# EAGLE design OpenPMU_BBB_Cape_V2.3 (EAGLE 9.3.0)
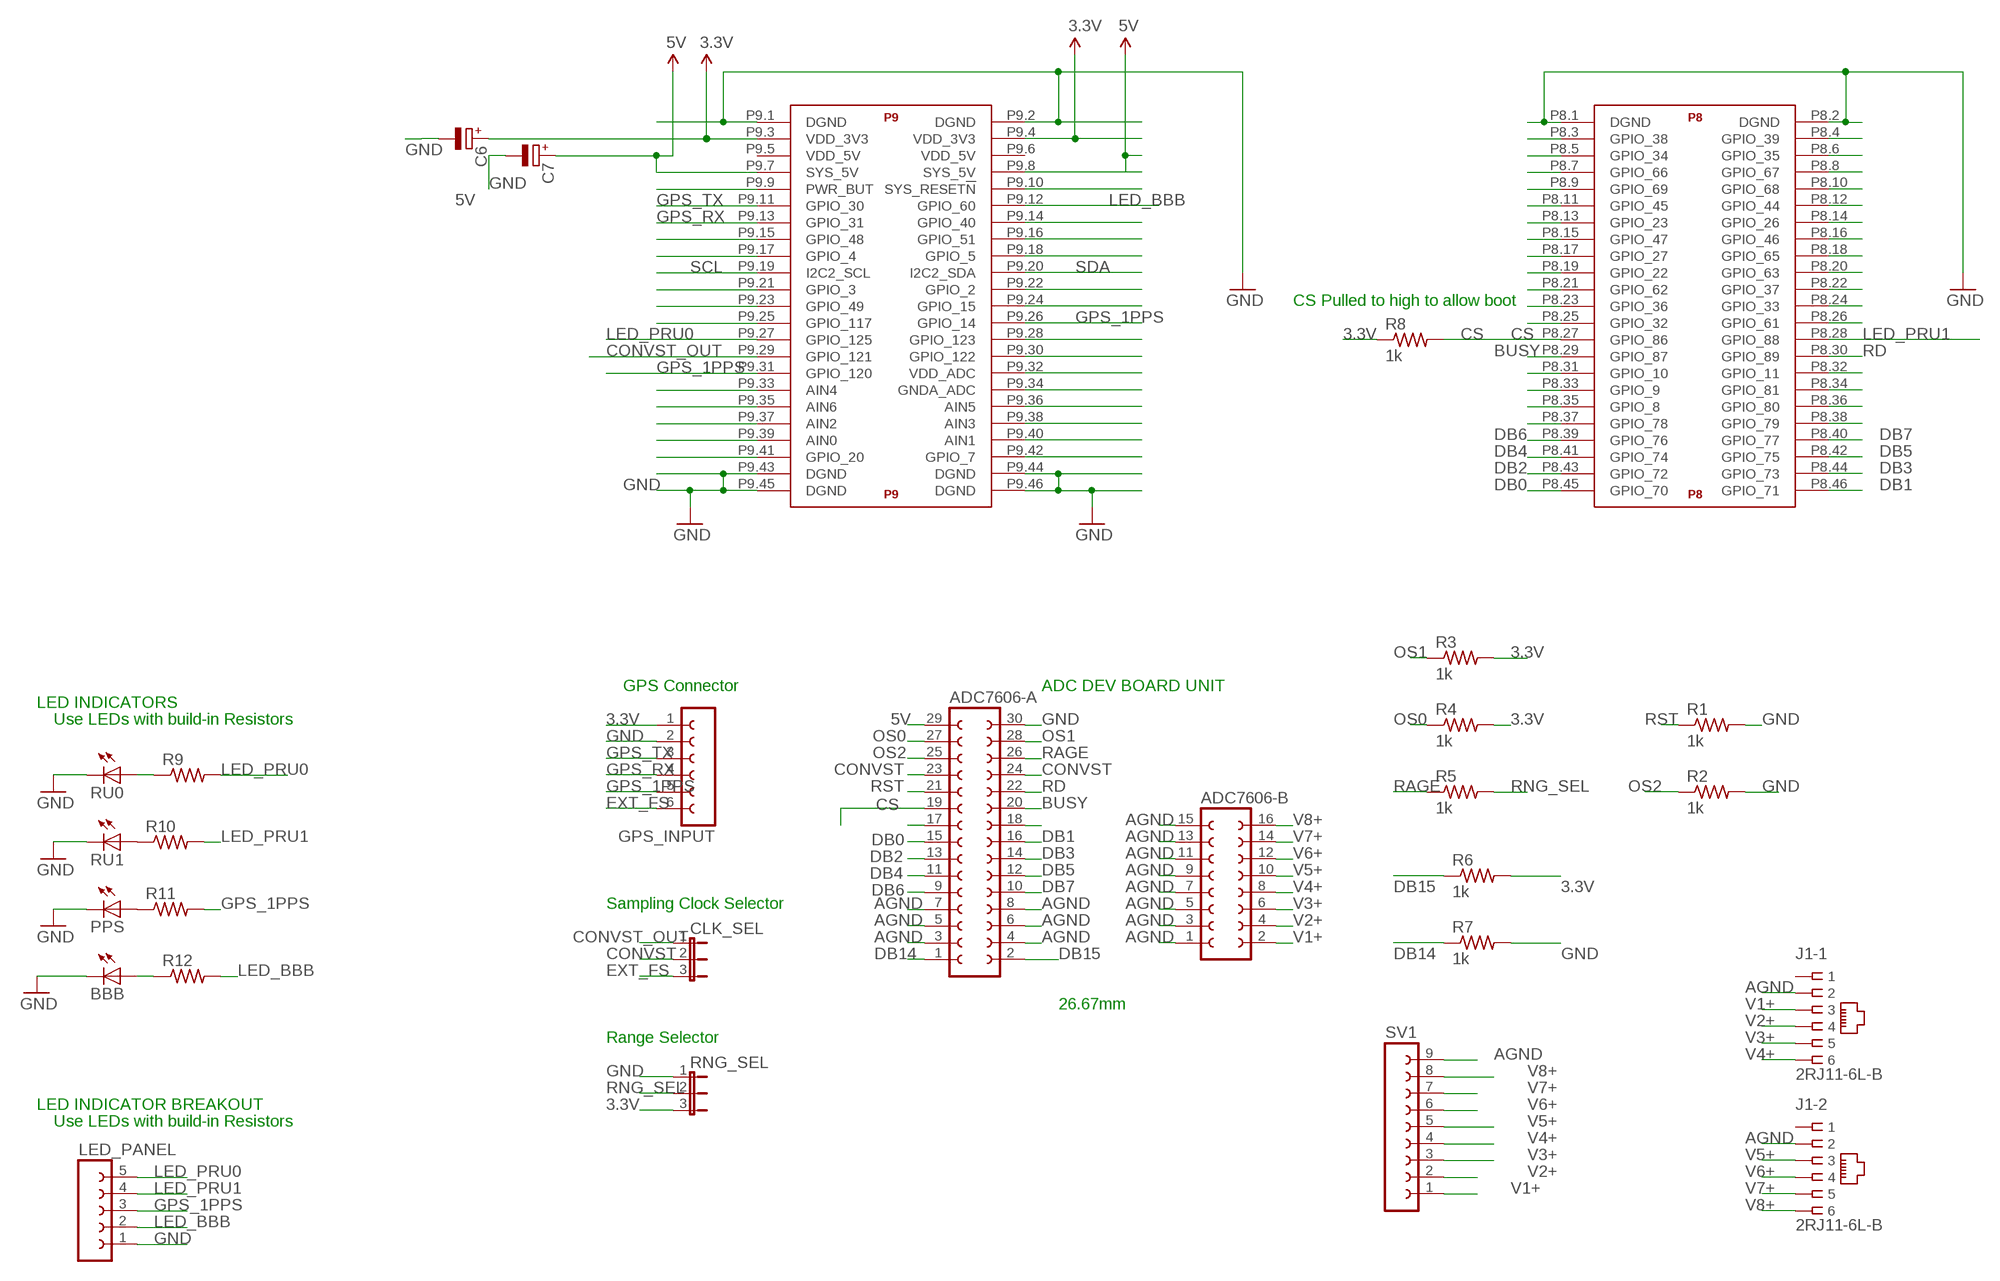
[diagram p0: schematic, sheet 1]

## Parts
ADC7606-A  FE15-2  [FE15-2]
ADC7606-B  FE08-2  [FE08-2]
BBB  LEDCHIPLED_1206  [CHIPLED_1206]
C6  CPOL-EUE1.8-4  [E1,8-4]
C7  CPOL-EUE1.8-4  [E1,8-4]
CLK_SEL  JP2E  [JP2]
GPS_INPUT  FE06-1  [FE06]
J1  2RJ11-6L-B  [2RJ11]
LED_PANEL  FE05-1  [FE05-1]
PPS  LEDCHIPLED_1206  [CHIPLED_1206]
R1  1k  R-US_0204/7  [0204/7]
R2  1k  R-US_0204/7  [0204/7]
R3  1k  R-US_0204/7  [0204/7]
R4  1k  R-US_0204/7  [0204/7]
R5  1k  R-US_0204/7  [0204/7]
R6  1k  R-US_0204/7  [0204/7]
R7  1k  R-US_0204/7  [0204/7]
R8  1k  R-US_0204/7  [0204/7]
R9  R-US_M1206  [M1206]
R10  R-US_M1206  [M1206]
R11  R-US_M1206  [M1206]
R12  R-US_M1206  [M1206]
RNG_SEL  JP2E  [JP2]
RU0  LEDCHIPLED_1206  [CHIPLED_1206]
RU1  LEDCHIPLED_1206  [CHIPLED_1206]
SV1  FE09-1  [FE09]
U$1  BEAGLE_BONE_BLACK_CAPE  [BEAGLE_BONE_BLACK_CAPE]

## Nets
3.3V: C6.+ GPS_INPUT.1 R3.2 R4.2 R6.2 R8.1 RNG_SEL.3 U$1.P9.3(P9:VDD_3V3) U$1.P9.4(P9:VDD_3V3)
5V: ADC7606-A.29 C7.+ U$1.P9.7(P9:SYS_5V) U$1.P9.8(P9:SYS_5V)
AGND: ADC7606-A.3 ADC7606-A.4 ADC7606-A.5 ADC7606-A.6 ADC7606-A.7 ADC7606-A.8 ADC7606-B.1 ADC7606-B.3 ADC7606-B.5 ADC7606-B.7 ADC7606-B.9 ADC7606-B.11 ADC7606-B.13 ADC7606-B.15 J1.1-2 J1.2-2 SV1.9
BUSY: ADC7606-A.20 U$1.P8.29(P8:GPIO_87)
CONVST: ADC7606-A.23 ADC7606-A.24 CLK_SEL.2
CONVST_OUT: CLK_SEL.1 U$1.P9.29(P9:GPIO_121)
CS: ADC7606-A.19 R8.2 U$1.P8.27(P8:GPIO_86)
DB0: ADC7606-A.15 U$1.P8.45(P8:GPIO_70)
DB1: ADC7606-A.16 U$1.P8.46(P8:GPIO_71)
DB2: ADC7606-A.13 U$1.P8.43(P8:GPIO_72)
DB3: ADC7606-A.14 U$1.P8.44(P8:GPIO_73)
DB4: ADC7606-A.11 U$1.P8.41(P8:GPIO_74)
DB5: ADC7606-A.12 U$1.P8.42(P8:GPIO_75)
DB6: ADC7606-A.9 U$1.P8.39(P8:GPIO_76)
DB7: ADC7606-A.10 U$1.P8.40(P8:GPIO_77)
DB14: ADC7606-A.1 R7.1
DB15: ADC7606-A.2 R6.1
EXT_FS: CLK_SEL.3 GPS_INPUT.6
FRST: ADC7606-A.18
GND: ADC7606-A.30 BBB.C C6.- C7.- GPS_INPUT.2 LED_PANEL.1 PPS.C R1.2 R2.2 R7.2 RNG_SEL.1 RU0.C RU1.C U$1.P8.1(P8:DGND) U$1.P8.2(P8:DGND) U$1.P9.1(P9:DGND) U$1.P9.2(P9:DGND) U$1.P9.43(P9:DGND) U$1.P9.44(P9:DGND) U$1.P9.45(P9:DGND) U$1.P9.46(P9:DGND)
GPS_1PPS: GPS_INPUT.5 LED_PANEL.3 R11.2 U$1.P9.26(P9:GPIO_14) U$1.P9.31(P9:GPIO_120)
GPS_RX: GPS_INPUT.4 U$1.P9.13(P9:GPIO_31)
GPS_TX: GPS_INPUT.3 U$1.P9.11(P9:GPIO_30)
LED_BBB: LED_PANEL.2 R12.2 U$1.P9.12(P9:GPIO_60)
LED_PRU0: LED_PANEL.5 R9.2 U$1.P9.27(P9:GPIO_125)
LED_PRU1: LED_PANEL.4 R10.2 U$1.P8.28(P8:GPIO_88)
N$1: R9.1 RU0.A
N$2: R10.1 RU1.A
N$3: PPS.A R11.1
N$4: BBB.A R12.1
N$12: U$1.P8.37(P8:GPIO_78)
N$13: U$1.P8.35(P8:GPIO_8)
N$14: U$1.P8.33(P8:GPIO_9)
N$15: U$1.P8.31(P8:GPIO_10)
N$18: U$1.P8.25(P8:GPIO_32)
N$19: U$1.P8.23(P8:GPIO_36)
N$20: U$1.P8.21(P8:GPIO_62)
N$21: U$1.P8.19(P8:GPIO_22)
N$22: U$1.P8.17(P8:GPIO_27)
N$23: U$1.P8.15(P8:GPIO_47)
N$24: U$1.P8.13(P8:GPIO_23)
N$25: U$1.P8.11(P8:GPIO_45)
N$26: U$1.P8.9(P8:GPIO_69)
N$27: U$1.P8.7(P8:GPIO_66)
N$28: U$1.P8.5(P8:GPIO_34)
N$29: U$1.P8.3(P8:GPIO_38)
N$35: U$1.P8.38(P8:GPIO_79)
N$36: U$1.P8.36(P8:GPIO_80)
N$37: U$1.P8.34(P8:GPIO_81)
N$38: U$1.P8.32(P8:GPIO_11)
N$41: U$1.P8.26(P8:GPIO_61)
N$42: U$1.P8.24(P8:GPIO_33)
N$43: U$1.P8.22(P8:GPIO_37)
N$44: U$1.P8.20(P8:GPIO_63)
N$45: U$1.P8.18(P8:GPIO_65)
N$46: U$1.P8.16(P8:GPIO_46)
N$47: U$1.P8.14(P8:GPIO_26)
N$48: U$1.P8.12(P8:GPIO_44)
N$49: U$1.P8.10(P8:GPIO_68)
N$50: U$1.P8.8(P8:GPIO_67)
N$51: U$1.P8.6(P8:GPIO_35)
N$52: U$1.P8.4(P8:GPIO_39)
N$56: U$1.P9.42(P9:GPIO_7)
N$57: U$1.P9.40(P9:AIN1)
N$58: U$1.P9.38(P9:AIN3)
N$59: U$1.P9.36(P9:AIN5)
N$60: U$1.P9.34(P9:GNDA_ADC)
N$61: U$1.P9.32(P9:VDD_ADC)
N$62: U$1.P9.30(P9:GPIO_122)
N$63: U$1.P9.28(P9:GPIO_123)
N$65: U$1.P9.24(P9:GPIO_15)
N$66: U$1.P9.22(P9:GPIO_2)
N$68: U$1.P9.18(P9:GPIO_5)
N$69: U$1.P9.16(P9:GPIO_51)
N$70: U$1.P9.14(P9:GPIO_40)
N$72: U$1.P9.10(P9:SYS_RESET!N)
N$79: U$1.P9.41(P9:GPIO_20)
N$80: U$1.P9.39(P9:AIN0)
N$81: U$1.P9.37(P9:AIN2)
N$82: U$1.P9.35(P9:AIN6)
N$83: U$1.P9.33(P9:AIN4)
N$87: U$1.P9.25(P9:GPIO_117)
N$88: U$1.P9.23(P9:GPIO_49)
N$89: U$1.P9.21(P9:GPIO_3)
N$91: U$1.P9.17(P9:GPIO_4)
N$92: U$1.P9.15(P9:GPIO_48)
N$95: U$1.P9.9(P9:PWR_BUT)
OS0: ADC7606-A.27 R4.1
OS1: ADC7606-A.28 R3.1
OS2: ADC7606-A.25 R2.1
RAGE: ADC7606-A.26 R5.1
RD: ADC7606-A.22 U$1.P8.30(P8:GPIO_89)
RNG_SEL: R5.2 RNG_SEL.2
RST: ADC7606-A.21 R1.1
SCL: U$1.P9.19(P9:I2C2_SCL)
SDA: U$1.P9.20(P9:I2C2_SDA)
V1+: ADC7606-B.2 J1.1-3 SV1.1
V2+: ADC7606-B.4 J1.1-4 SV1.2
V3+: ADC7606-B.6 J1.1-5 SV1.3
V4+: ADC7606-B.8 J1.1-6 SV1.4
V5+: ADC7606-B.10 J1.2-3 SV1.5
V6+: ADC7606-B.12 J1.2-4 SV1.6
V7+: ADC7606-B.14 J1.2-5 SV1.7
V8+: ADC7606-B.16 J1.2-6 SV1.8
VI0: ADC7606-A.17
Unconnected: J1.1-1 J1.2-1 U$1.P9.5(P9:VDD_5V) U$1.P9.6(P9:VDD_5V)

## Notes on the sheet
- CS Pulled to high to allow boot
- GPS Connector | ADC DEV BOARD UNIT
- LED INDICATORS
- Use LEDs with build-in Resistors
- Sampling Clock Selector
- 26.67mm
- Range Selector
- LED INDICATOR BREAKOUT
- Use LEDs with build-in Resistors

## Library data of the parts
ADC7606-A = con-lsta:FE15-2: FEMALE HEADER; OC_FARNELL: unknown; OC_NEWARK: unknown
ADC7606-B = con-lsta:FE08-2: FEMALE HEADER; OC_FARNELL: unknown; OC_NEWARK: unknown
BBB PPS RU0 RU1 = led:LED: LED OSRAM: - CHIPLED LG R971, LG N971, LY N971, LG Q971, LY Q971, LO R971, LY R971 LH N974, LH R974 LS Q976, LO Q976, LY Q976 LO Q996 - Hyper CHIPLED LW Q18S LB Q993, LB Q99A, LB R99A - SideLED LS A670, LO A670, LY A670, LG A670, LP A670 LB A673, LV A673, LT A673, LW A673 LH A674 LY A675 LS A676, LA A676, LO A676, LY A676, LW A676 LS A679, LY A679, LG A679 - Hyper Micro SIDELED® LS Y876, LA Y876, LO Y876, LY Y876 LT Y87S - SmartLED LW L88C, LW L88S LB L89C, LB L89S, LG L890 LS L89K, LO L89K, LY L89K LS L896, LA L896, LO L896, LY L896 - TOPLED LS T670, LO T670, LY T670, LG T670, LP T670 LSG T670, LSP T670, LSY T670, LOP T670, LYG T670 LG T671, LOG T671, LSG T671 LB T673, LV T673, LT T673, LW T673 LH T674 LS T676, LA T676, LO T676, LY T676, LB T676, LH T676, LSB T676, LW T676 LB T67C, LV T67C, LT T67C, LS T67K, LO T67K, LY T67K, LW E67C LS E67B, LA E67B, LO E67B, LY E67B, LB E67C, LV E67C, LT E67C LW T67C LS T679, LY T679, LG T679 LS T770, LO T770, LY T770, LG T770, LP T770 LB T773, LV T773, LT T773, LW T773 LH T774 LS E675, LA E675, LY E675, LS T675 LS T776, LA T776, LO T776, LY T776, LB T776 LHGB T686 LT T68C, LB T68C - Hyper Mini TOPLED® LB M676 - Mini TOPLED Santana® LG M470 LS M47K, LO M47K, LY M47K Source: http://www.osram.convergy.de LUXEON: - LUMILED® LXK2-PW12-R00, LXK2-PW12-S00, LXK2-PW14-U00, LXK2-PW14-V00 LXK2-PM12-R00, LXK2-PM12-S00, LXK2-PM14-U00 LXK2-PE12-Q00, LXK2-PE12-R00, LXK2-PE12-S00, LXK2-PE14-T00, LXK2-PE14-U00 LXK2-PB12-K00, LXK2-PB12-L00, LXK2-PB12-M00, LXK2-PB14-N00, LXK2-PB14-P00, LXK2-PB14-Q00 LXK2-PR12-L00, LXK2-PR12-M00, LXK2-PR14-Q00, LXK2-PR14-R00 LXK2-PD12-Q00, LXK2-PD12-R00, LXK2-PD12-S00 LXK2-PH12-R00, LXK2-PH12-S00 LXK2-PL12-P00, LXK2-PL12-Q00, LXK2-PL12-R00 Source: www.luxeon.com KINGBRIGHT: KA-3528ASYC Source: www.kingbright.com
C6 C7 = resistor:CPOL-EU: POLARIZED CAPACITOR, European symbol
CLK_SEL RNG_SEL = jumper:JP2E: JUMPER
GPS_INPUT = con-lsta:FE06-1: FEMALE HEADER; OC_FARNELL: unknown; OC_NEWARK: unknown
J1 = con-tycoelectronics:2RJ11-6L-B: CORCOM Modular RJ Jacks L - Ganged Series Source: www.tycoelectronics.com .. ENG_DS_1654001_1099_RJ_L_0507.pdf; MF: TYCO ELECTRONICS; MPN: 2RJ11-6L-B; OC_FARNELL: unknown; OC_NEWARK: 48F3954
LED_PANEL = con-lsta:FE05-1: FEMALE HEADER; OC_FARNELL: unknown; OC_NEWARK: unknown
R1-R12 = adafruit:R-US_: RESISTOR, American symbol
SV1 = con-lsta:FE09-1: FEMALE HEADER; OC_FARNELL: unknown; OC_NEWARK: unknown
U$1 = SparkFun-Boards:BEAGLE_BONE_BLACK_CAPE

## Board
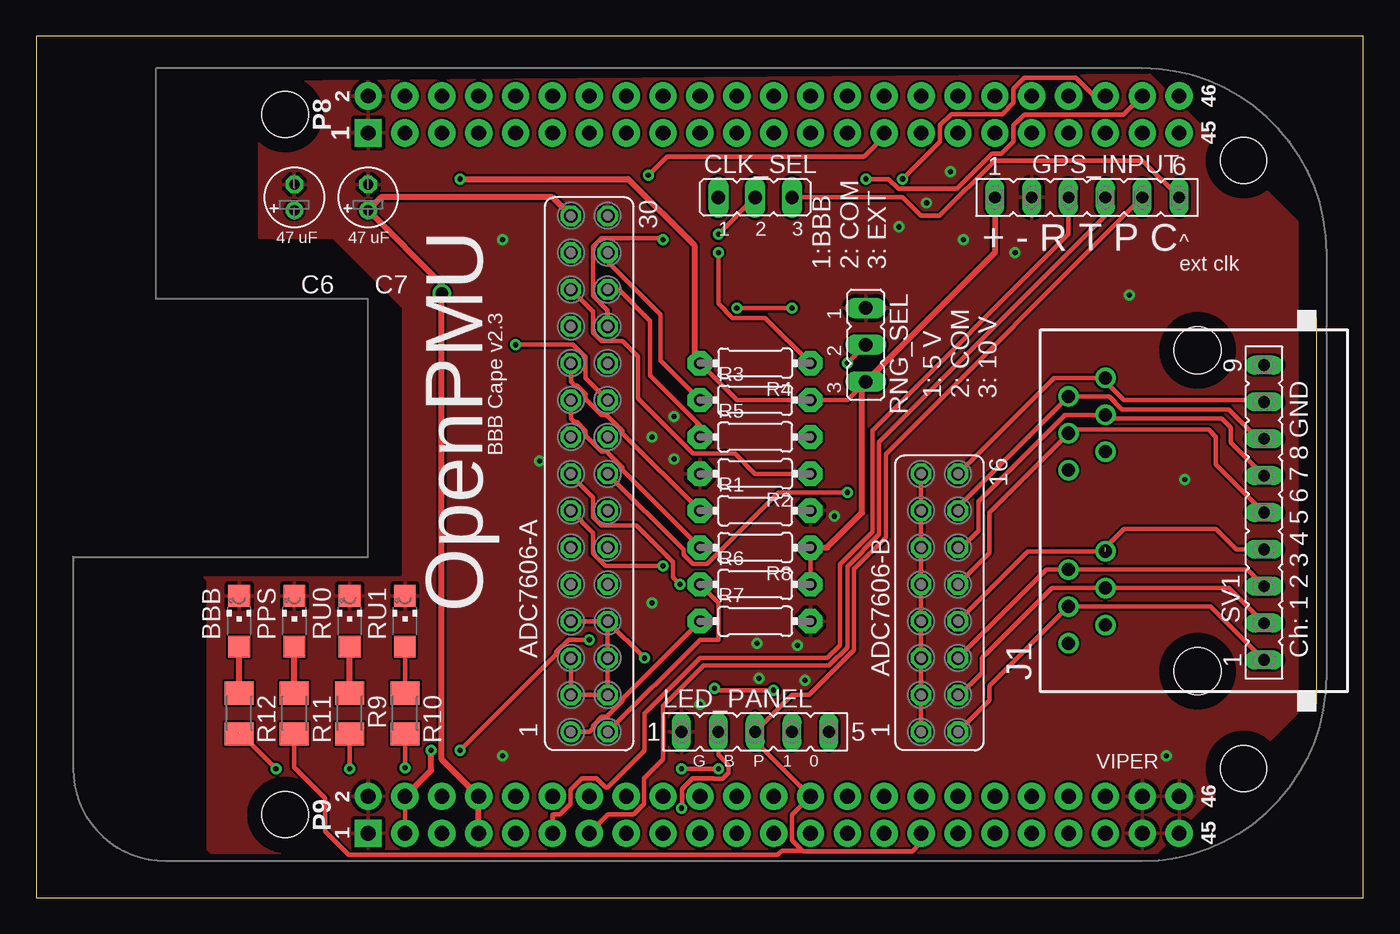
[diagram p1: board, top side]
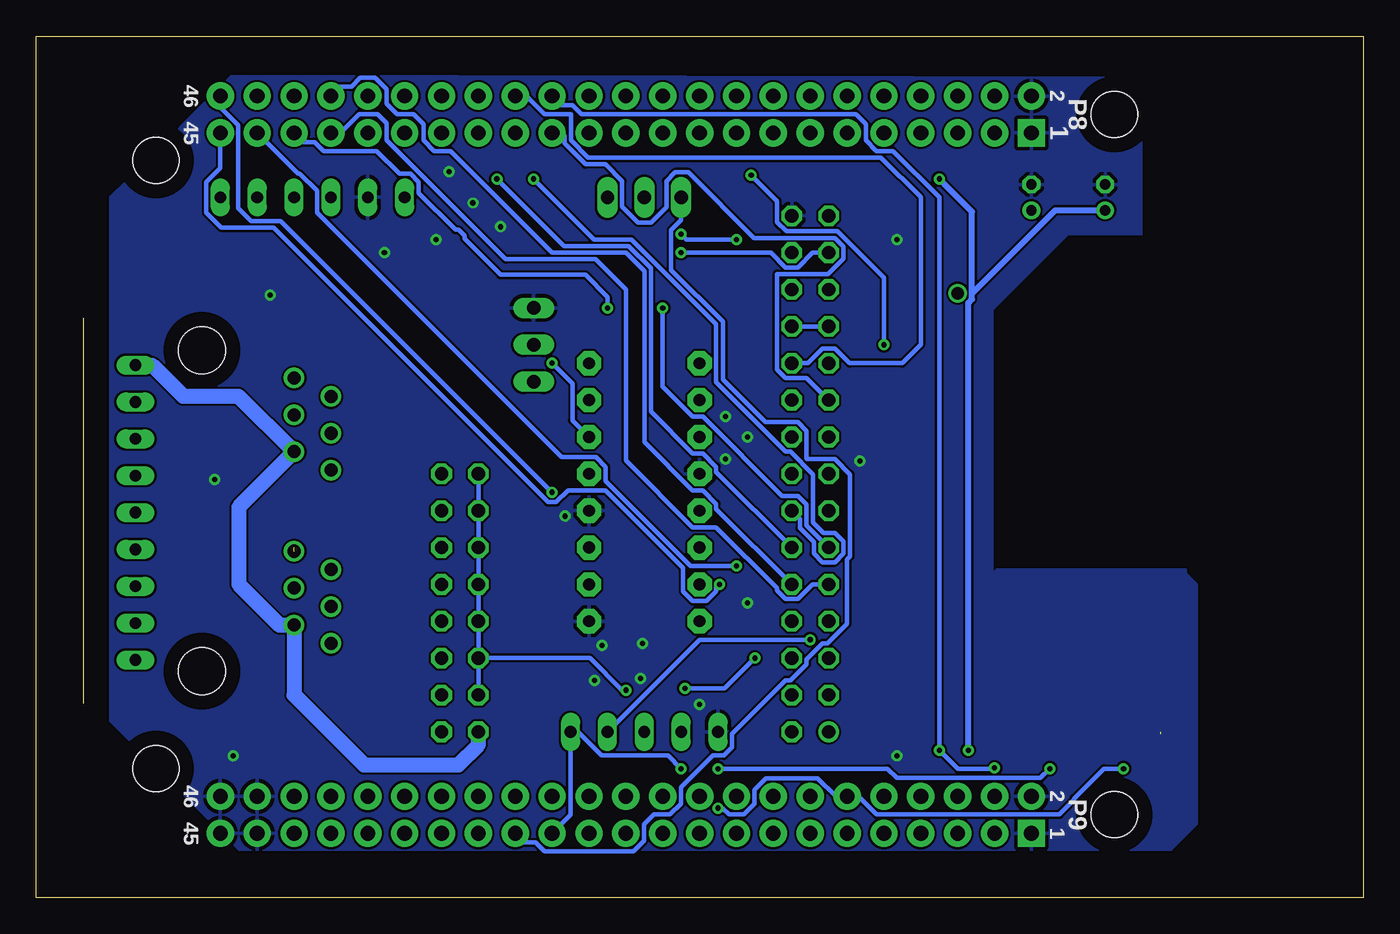
[diagram p2: board, bottom side, seen from below]

Size 91.42 x 59.36 mm. Coordinates in mm from the lower left corner, seen from the top.
Outline: 0,0 91.42,0 91.42,59.36 0,59.36 0,0
Copper layers (1*16): Top 0.035mm / dielectric 1.5mm / Bottom 0.035mm
Design rules "default": minimum track width 6mil, minimum drill 0.35mm, track to track 6mil, track to pad 6mil, pad to pad 6mil, via to via 6mil, smd to smd 6mil, copper to edge 40mil, drill to drill 6mil, minimum pad ring 10mil, minimum via ring 8mil, stop-mask expansion 4mil, vias tented up to drill 0mil, thermal gap 10mil

### Footprints (pad centres in the part's own frame; a part is rotated, then mirrored left to right if it is on the bottom)
FE15-2 = drill 0.914: 1 -17.78,1.27 | drill 0.914 octagon: 2 -17.78,-1.27; 3 -15.24,1.27; 4 -15.24,-1.27; 5 -12.7,1.27; 6 -12.7,-1.27; 7 -10.16,1.27; 8 -10.16,-1.27; 9 -7.62,1.27; 10 -7.62,-1.27; 11 -5.08,1.27; 12 -5.08,-1.27; 13 -2.54,1.27; 14 -2.54,-1.27; 15 0,1.27; 16 0,-1.27; 17 2.54,1.27; 18 2.54,-1.27; 19 5.08,1.27; 20 5.08,-1.27; 21 7.62,1.27; 22 7.62,-1.27; 23 10.16,1.27; 24 10.16,-1.27; 25 12.7,1.27; 26 12.7,-1.27; 27 15.24,1.27; 28 15.24,-1.27; 29 17.78,1.27; 30 17.78,-1.27
FE08-2 = drill 0.914 octagon: 1 -8.89,1.27; 2 -8.89,-1.27; 3 -6.35,1.27; 4 -6.35,-1.27; 5 -3.81,1.27; 6 -3.81,-1.27; 7 -1.27,1.27; 8 -1.27,-1.27; 9 1.27,1.27; 10 1.27,-1.27; 11 3.81,1.27; 12 3.81,-1.27; 13 6.35,1.27; 14 6.35,-1.27; 15 8.89,1.27; 16 8.89,-1.27
CHIPLED_1206 = smd 1.5 x 1.5: A 0,-1.75; C 0,1.75
E1,8-4 = drill 0.711 pad 1.168: + -0.889,0 | drill 0.711 pad 1.168 octagon: - 0.889,0
JP2 = drill 0.914 long: 1 -2.54,0; 2 0,0; 3 2.54,0
FE06 = drill 0.813 long: 1 -6.35,0; 2 -3.81,0; 3 -1.27,0; 4 1.27,0; 5 3.81,0; 6 6.35,0
2RJ11 = drill 0.9 pad 1.4: 1-1 -9.144,8.89; 1-2 -7.874,6.35; 1-3 -6.604,8.89; 1-4 -5.334,6.35; 1-5 -4.064,8.89; 1-6 -2.794,6.35; 2-1 2.794,8.89; 2-2 4.064,6.35; 2-3 5.334,8.89; 2-4 6.604,6.35; 2-5 7.874,8.89; 2-6 9.144,6.35 | hole 3.251: -11.049,0; 11.049,0
FE05-1 = drill 0.813 long: 1 -5.08,0; 2 -2.54,0; 3 0,0; 4 2.54,0; 5 5.08,0
0204/7 = drill 0.813 pad 1.676 octagon: 1 -3.81,0; 2 3.81,0
M1206 = smd 1.6 x 2: 1 -1.4,0; 2 1.4,0
FE09 = drill 0.813 long: 1 -10.16,0; 2 -7.62,0; 3 -5.08,0; 4 -2.54,0; 5 0,0; 6 2.54,0; 7 5.08,0; 8 7.62,0; 9 10.16,0
BEAGLE_BONE_BLACK_CAPE = drill 1.016 pad 1.88 square: P8.1 20.32,50.165; P9.1 20.32,1.905 | drill 1.016 pad 1.88: P8.2 20.32,52.705; P8.3 22.86,50.165; P8.4 22.86,52.705; P8.5 25.4,50.165; P8.6 25.4,52.705; P8.7 27.94,50.165; P8.8 27.94,52.705; P8.9 30.48,50.165; P8.10 30.48,52.705; P8.11 33.02,50.165; P8.12 33.02,52.705; P8.13 35.56,50.165; P8.14 35.56,52.705; P8.15 38.1,50.165; P8.16 38.1,52.705; P8.17 40.64,50.165; P8.18 40.64,52.705; P8.19 43.18,50.165; P8.20 43.18,52.705; P8.21 45.72,50.165; P8.22 45.72,52.705; P8.23 48.26,50.165; P8.24 48.26,52.705; P8.25 50.8,50.165; P8.26 50.8,52.705; P8.27 53.34,50.165; P8.28 53.34,52.705; P8.29 55.88,50.165; P8.30 55.88,52.705; P8.31 58.42,50.165; P8.32 58.42,52.705; P8.33 60.96,50.165; P8.34 60.96,52.705; P8.35 63.5,50.165; P8.36 63.5,52.705; P8.37 66.04,50.165; P8.38 66.04,52.705; P8.39 68.58,50.165; P8.40 68.58,52.705; P8.41 71.12,50.165; P8.42 71.12,52.705; P8.43 73.66,50.165; P8.44 73.66,52.705; P8.45 76.2,50.165; P8.46 76.2,52.705; P9.2 20.32,4.445; P9.3 22.86,1.905; P9.4 22.86,4.445; P9.5 25.4,1.905; P9.6 25.4,4.445; P9.7 27.94,1.905; P9.8 27.94,4.445; P9.9 30.48,1.905; P9.10 30.48,4.445; P9.11 33.02,1.905; P9.12 33.02,4.445; P9.13 35.56,1.905; P9.14 35.56,4.445; P9.15 38.1,1.905; P9.16 38.1,4.445; P9.17 40.64,1.905; P9.18 40.64,4.445; P9.19 43.18,1.905; P9.20 43.18,4.445; P9.21 45.72,1.905; P9.22 45.72,4.445; P9.23 48.26,1.905; P9.24 48.26,4.445; P9.25 50.8,1.905; P9.26 50.8,4.445; P9.27 53.34,1.905; P9.28 53.34,4.445; P9.29 55.88,1.905; P9.30 55.88,4.445; P9.31 58.42,1.905; P9.32 58.42,4.445; P9.33 60.96,1.905; P9.34 60.96,4.445; P9.35 63.5,1.905; P9.36 63.5,4.445; P9.37 66.04,1.905; P9.38 66.04,4.445; P9.39 68.58,1.905; P9.40 68.58,4.445; P9.41 71.12,1.905; P9.42 71.12,4.445; P9.43 73.66,1.905; P9.44 73.66,4.445; P9.45 76.2,1.905; P9.46 76.2,4.445 | hole 3.175: 14.605,3.175; 80.645,6.35; 80.645,48.26; 14.605,51.435

### Placement (x,y rotation side)
ADC7606-A  38.1,29.21 90 top
ADC7606-B  62.23,20.32 90 top
BBB  13.97,19.05 0 top
C6  17.78,48.26 90 top
C7  22.86,48.26 90 top
CLK_SEL  49.53,48.26 0 top
GPS_INPUT  72.39,48.26 0 top
J1  80.01,26.67 90 top
LED_PANEL  49.53,11.43 0 top
PPS  17.78,19.05 0 top
R1  49.53,26.67 0 top
R2  49.53,29.21 180 top
R3  49.53,34.29 0 top
R4  49.53,36.83 180 top
R5  49.53,31.75 0 top
R6  49.53,21.59 0 top
R7  49.53,19.05 0 top
R8  49.53,24.13 180 top
R9  21.59,12.7 270 top
R10  25.4,12.7 270 top
R11  17.78,12.7 270 top
R12  13.97,12.7 270 top
RNG_SEL  57.15,38.1 270 top
RU0  21.59,19.05 0 top
RU1  25.4,19.05 0 top
SV1  84.58,26.54 90 top
U$1  2.54,2.54 0 top

### Tracks (layer width: path | path; a pad name or v marks a point on that pad's centre or on a via)
3.3V  (via drill 0.35)
  Top 0.305: R8.1 R6.2 | R4.2 48.26,34.29 R3.2 55.88,34.29 RNG_SEL.3 | U$1.P9.4 U$1.P9.3
  Top 0.406: U$1.P9.4 27.21,8.79 v27.21,10.16 | R4.2 45.34,37.21 45.34,44.96 40.77,49.53 v29.21,49.53 | GPS_INPUT.1 66.04,44.45 RNG_SEL.3 56.9,35.31 56.9,26.54 54.48,24.13 R8.1
  Bottom 0.406: v27.21,10.16 27.21,40.98 26.95,41.24 26.95,41.63 | C6.+ 21.21,47.37 26.95,41.63 | 26.95,41.63 26.95,47.27 v29.21,49.53
5V  (via drill 0.85)
  Top 0.305: 27.94,41.91 v27.94,41.66 27.94,42.29
  Top 0.406: v27.94,41.66 27.94,9.53 U$1.P9.8 U$1.P9.7 | 27.94,42.29 C7.+ 23.75,48.26 35.56,48.26 ADC7606-A.29
AGND  (via drill 0.35)
  Top 0.305: ADC7606-B.15 ADC7606-B.1 | ADC7606-A.8 ADC7606-A.6 ADC7606-A.4 ADC7606-A.3 ADC7606-A.5 | ADC7606-A.7 ADC7606-A.8 | ADC7606-A.8 v41.91,16.51 | v50.8,14.3 46.86,14.3 v46.74,14.43
  Bottom 0.305: v41.91,16.51 43.99,14.43 v46.74,14.43 | v50.8,14.3 51.06,14.3 53.26,16.51 ADC7606-B.5 | ADC7606-B.15 ADC7606-B.13 ADC7606-B.11 ADC7606-B.9 ADC7606-B.7 ADC7606-B.5 | ADC7606-B.5 ADC7606-B.3
  Bottom 1.016: SV1.9 83.45,36.7 81.31,34.57 77.5,34.57 J1.2-2 77.47,26.92 77.47,21.59 74.68,18.8 J1.1-2 73.66,13.97 68.83,9.14 62.36,9.14 60.96,10.54 ADC7606-B.1
BUSY  (via drill 0.35)
  Top 0.305: v42.16,49.78 43.46,51.08 57.03,51.08 58.42,52.47 U$1.P8.29 | ADC7606-A.20 37.85,35.81 37.85,37.25 37,38.1 v33.02,38.1
  Bottom 0.305: U$1.P8.29 58.42,52.07 | v42.16,49.78 40.39,48.01 40.39,46.57 39.74,45.92 36.22,45.92 33.02,42.72 v33.02,38.1
CONVST  (via drill 0.35)
  Top 0.305: CLK_SEL.2 v46.99,45.72 | ADC7606-A.24 39.37,40.47 38.35,41.49 38.35,44.87 38.95,45.47 43.05,45.47 v43.18,45.34
  Bottom 0.305: v46.99,45.72 46.61,45.34 v43.18,45.34 | ADC7606-A.24 ADC7606-A.23
CONVST_OUT
  Bottom 0.305: CLK_SEL.1 46.99,46.69 47.67,46 47.67,43.26 44.12,39.71 44.12,35.71 41.18,32.77 38.95,32.77 38.35,32.17 38.35,30.28 38.3,30.23 36.41,30.23 35.36,29.17 35.36,23.52 35.56,23.32 35.56,18.88 36.92,17.53 37.25,17.53 38.35,16.42 38.35,16.09 39.46,14.99 39.79,14.99 43.48,11.29 43.48,10.37 44.05,9.8 44.81,9.8 47.02,7.59 47.02,6.47 47.74,5.74 48.87,5.74 49.55,5.05 49.55,3.93 50.28,3.2 56.4,3.2 57.01,3.81 58.42,3.81 U$1.P9.29
CS
  Top 0.305: ADC7606-A.19 36.83,33.02 37.08,32.77 37.25,32.77 37.85,32.17 37.85,31.84 38.95,30.73 39.28,30.73 40.39,29.63 40.39,29.46 R8.2
  Bottom 0.305: U$1.P8.27 55.24,52.7 55.04,52.5 55.04,52 53.59,50.55 52.21,50.55 51.05,49.39 51.05,47.64 49.95,46.53 49.07,46.53 48.01,47.6 48.01,49.39 47.41,49.99 46.48,49.99 41.96,45.47 36.41,45.47 35.81,44.87 35.81,44.03 36.87,42.98 40.39,42.98 40.39,36.41 39.79,35.81 38.35,35.81 ADC7606-A.19
DB0  (via drill 0.35)
  Top 0.305: ADC7606-A.15 36.83,29.11 38.35,27.59 38.35,26.25 38.95,25.65 41.35,25.65 43.86,23.14 43.86,22.08 v44.35,21.59
  Bottom 0.305: v44.35,21.59 44.58,21.36 44.58,21.12 45.25,20.45 46.19,20.45 46.86,21.12 46.86,22.72 52.21,28.07 54.79,28.07 55.6,27.26 56.16,27.26 75.08,46.18 78.68,46.18 79.7,47.2 79.7,49.32 78.74,50.28 U$1.P8.45
DB1  (via drill 0.35)
  Top 0.305: v55.88,27.94 51.15,27.94 46.19,22.99 45.25,22.99 44.58,23.66 44.58,24 ADC7606-A.16
  Bottom 0.305: v55.88,27.94 74.57,46.63 76.6,46.63 77.5,47.53 77.5,53.22 78.74,54.47 U$1.P8.46 78.74,55.88
DB2  (via drill 0.35)
  Top 0.305: ADC7606-A.13 38.35,25.15 38.35,23.71 39.2,22.86 v43.18,22.86
  Bottom 0.305: v43.18,22.86 46.35,22.86 52.2,28.7 52.2,29.68 52.87,30.35 55.24,30.35 72.08,47.2 72.08,48.71 73.26,49.89 73.38,49.89 U$1.P8.43
DB3  (via drill 0.35)
  Top 0.305: v57.15,49.53 58.72,49.53 59.41,48.85 63.44,48.85 65.85,51.26 66.5,51.26 67.33,52.09 67.33,53.22 68.06,53.95 74.91,53.95 U$1.P8.44
  Bottom 0.305: v57.15,49.53 52.98,45.36 50.42,45.36 44.58,39.52 44.58,35.52 39.79,30.73 39.46,30.73 37.9,29.17 37.9,25.84 37.2,25.15 36.41,25.15 35.81,24.55 35.81,23.71 36.41,23.11 37.25,23.11 37.85,23.71 37.85,24.5 38.81,25.46 38.81,26.11 ADC7606-A.14
DB4  (via drill 0.35)
  Top 0.305: v48.26,40.64 v52.07,40.64
  Bottom 0.305: ADC7606-A.11 38.35,25.65 38.35,27.09 38.95,27.69 40.04,27.69 45.5,33.15 46.19,33.15 48.26,35.21 v48.26,40.64 | U$1.P8.41 73.66,52.07 72.25,52.07 71.64,51.46 67.97,51.46 66.4,49.89 65.64,49.89 65.08,49.32 65.08,48.56 62.53,46.02 62.33,46.02 61.93,45.62 61.93,45.42 59.44,42.93 53.59,42.93 52.07,41.4 v52.07,40.64
DB5  (via drill 0.35)
  Top 0.305: v59.69,49.53 62.26,52.09 62.26,53.22 63.03,54 66.56,54 67.33,54.78 67.33,55.76 68.06,56.49 71.64,56.49 72.88,55.24 U$1.P8.42
  Bottom 0.305: ADC7606-A.12 44.58,29.34 44.58,29.68 45.5,30.61 46.19,30.61 49.07,33.49 49.07,43.37 50.61,44.91 55.07,44.91 v59.69,49.53
DB6
  Bottom 0.152: U$1.P8.39 71.12,52.07
  Bottom 0.305: ADC7606-A.9 37.93,21.59 38.95,20.57 39.79,20.57 40.39,21.17 40.39,21.34 44.58,25.53 46.19,25.53 50.8,30.13 50.8,41.91 52.88,43.99 59.09,43.99 67.28,52.19 67.28,53.39 67.9,54 69.19,54 71.12,52.07
DB7
  Bottom 0.305: ADC7606-A.10 44.58,26.8 44.58,27.14 45.5,28.07 46.19,28.07 49.53,31.4 49.53,43.18 50.8,44.45 55.88,44.45 62.89,51.46 64.02,51.46 64.75,52.19 64.75,53.31 65.43,54 66.56,54 67.28,54.73 67.28,55.71 68.06,56.49 69.1,56.49 69.7,55.88 71.12,55.88 U$1.P8.40
DB14
  Top 0.305: ADC7606-A.1 38.1,11.43 38.35,11.68 38.35,11.85 38.95,12.45 39.28,12.45 40.39,13.55 40.39,13.72 R7.1
DB15
  Top 0.305: R6.1 46.99,20.32 46.99,17.78 45.72,17.78 ADC7606-A.2
EXT_FS
  Top 0.305: CLK_SEL.3 59.69,48.26 60.96,46.99 62.23,46.99 66.04,50.8 76.2,50.8 GPS_INPUT.6
GND  (via drill 0.35)
  Top 0.305: 68.58,46.99 GPS_INPUT.2
  other vias: 54.99,26.29 52.45,17.4 34.67,30.1 77.85,9.78 59.44,46.23 67.44,44.45 75.31,41.53 32.13,45.34 32.13,9.78 45.72,13.34 49.78,15.11 52.96,14.99 49.66,17.53 61.34,47.88 62.99,50.04 43.94,33.15 42.42,31.75 43.94,30.23 42.42,20.32 63.88,45.34 79.12,28.83
  pour Top: 76.72,56.76 86.87,46.61 86.87,12.7 77.22,3.05 12.06,3.05 11.81,3.3 11.81,21.84 11.56,22.1 25.15,22.1 25.27,22.23 25.27,40.64 20.45,45.47 15.37,45.47 15.37,56.26
  pour Bottom: 77.98,56.64 85.09,49.53 86.36,48.26 86.36,12.7 86.36,12.19 77.47,3.3 13.21,3.3 11.43,5.08 11.43,21.59 12.19,22.35 12.19,22.61 25.27,22.61 25.53,22.35 25.53,40.51 20.32,45.72 15.24,45.72 15.24,56.52
GPS_1PPS
  Top 0.305: GPS_INPUT.5 58.52,30.58 58.52,24.83 56.34,22.65 56.34,17.07 53.24,13.97 52.07,13.97 LED_PANEL.3 | 49.53,12.7 LED_PANEL.3 | LED_PANEL.3 49.53,10.79 U$1.P9.26 52.07,5.71 52.07,3.96 52.78,3.25 | U$1.P9.31 60.96,3.81 60.35,3.2 52.82,3.2 52.78,3.25 | 52.78,3.25 51.36,3.25 51.07,2.96 21.52,2.96 19.9,4.57 19.9,6.86 17.78,8.98 R11.2
GPS_RX
  Top 0.305: GPS_INPUT.4 73.66,46.99 58.06,31.39 58.06,25.02 55.88,22.84 55.88,17.26 54.62,16 45.97,16 43.18,13.21 43.18,9.53 41.88,8.23 41.88,6.47 41.16,5.74 39.4,5.74 U$1.P9.13
GPS_TX
  Top 0.305: GPS_INPUT.3 71.12,45.72 57.61,32.21 57.61,25.21 55.37,22.98 55.37,17.4 54.48,16.51 45.72,16.51 41.91,12.7 41.91,10.16 39.37,7.62 39.23,7.62 38.62,8.23 37.58,8.23 36.8,7.45 36.8,6.47 36.08,5.74 35.61,5.74 35.56,5.69 U$1.P9.11 35.56,3.81
LED_BBB  (via drill 0.35)  (1 unrouted)
  Top 0.305: v44.45,6.18 44.48,6.2 44.48,7.5 45.2,8.23 46.68,8.23 46.71,8.21 47.27,8.21 47.67,8.61 47.67,9.17 46.99,9.86 LED_PANEL.2 | v16.51,8.89 13.97,11.43
  Bottom 0.305: v44.45,6.18 44.13,6.18 43.7,5.74 42.66,5.74 41.94,6.47 41.94,7.45 41.16,8.23 37.58,8.23 36.34,6.99 U$1.P9.12 34.78,6.99 33.54,5.74 20.93,5.74 20.32,6.35 19.9,6.77 19.9,6.86 17.87,8.89 v16.51,8.89
LED_PRU0  (via drill 0.35)
  Top 0.305: v46.99,8.89 v44.45,8.89 | 21.72,11.3 R9.2 v21.59,8.89
  Bottom 0.305: 55.88,5.08 U$1.P9.27 54.61,5.71 LED_PANEL.5 54.09,11.43 52.47,9.8 47.9,9.8 v46.99,8.89 | v44.45,8.89 32.77,8.89 32.13,8.26 22.23,8.26 v21.59,8.89
LED_PRU1  (via drill 0.35)
  Top 0.305: v29.21,10.16 35.81,16.76 35.81,16.93 36.66,17.78 v38.1,17.78 | v25.4,8.94 R10.2
  Bottom 0.305: v38.1,17.78 45.72,17.78 LED_PANEL.4 | U$1.P8.28 55.88,54.61 54.47,54.61 53.86,54 34.95,54 34.27,53.31 34.27,52.19 33.54,51.46 32.41,51.46 29.21,48.26 v29.21,10.16 27.94,8.89 25.4,8.89 v25.4,8.94
N$1
  Top 0.406: R9.1 RU0.A
N$2
  Top 0.305: R10.1 RU1.A
N$3
  Top 0.406: R11.1 PPS.A
N$4
  Top 0.406: R12.1 BBB.A
OS0  (via drill 0.35)
  Top 0.305: R4.1 50.21,39.96 47.98,39.96 46.99,40.94 v46.99,44.45
  Bottom 0.305: v46.99,44.45 40.81,44.45 39.79,43.43 38.95,43.43 37.93,44.45 ADC7606-A.27
OS1
  Top 0.305: R3.1 43,37.01 43,40.19 39.37,43.83 ADC7606-A.28
OS2
  Top 0.305: R2.1 49.53,29.21 48.13,30.61 45.25,30.61 41.45,34.4 41.45,37.29 40.39,38.35 38.95,38.35 38.35,38.95 38.35,40.39 ADC7606-A.25
  Bottom 0.305: R2.1 52.85,29.7
RAGE
  Top 0.305: ADC7606-A.26 40.13,41.91 42.29,39.75 42.29,35.98 45.72,32.55 R5.1
RD
  Bottom 0.305: U$1.P8.30 57.64,55.24 56.4,54 54.59,54 54.59,52.19 53.4,51 33.22,51 30.48,48.26 30.48,38.1 31.75,36.83 35.39,36.83 36.41,37.85 37.25,37.85 38.27,36.83 ADC7606-A.22
RNG_SEL  (via drill 0.35)
  Top 0.305: RNG_SEL.2 v55.88,36.83
  Bottom 0.305: v55.88,36.83 54.48,35.43 54.48,32.89 R5.2
RST
  Top 0.305: ADC7606-A.21 36.83,35.56 37.08,35.31 37.25,35.31 37.85,34.71 37.85,34.38 38.95,33.27 39.28,33.27 40.39,32.17 40.39,32 R1.1
V1+
  Top 0.305: SV1.1 80.9,20.07 J1.1-3 65.66,14.61 65.66,13.59 ADC7606-B.2
V2+
  Top 0.305: SV1.2 82.17,21.34 J1.1-4 69.98,21.34 65.15,16.51 65.15,15.49 63.63,13.97 ADC7606-B.4
V3+
  Top 0.305: SV1.3 83.44,22.61 J1.1-5 69.6,22.61 ADC7606-B.6
V4+  (1 unrouted)
  Top 0.305: SV1.4 82.68,24 81.28,25.4 74.93,25.4 73.66,24.13 | J1.1-6 68.33,23.88 ADC7606-B.8
V5+
  Top 0.305: SV1.5 81.28,29.84 81.28,31.75 80.77,32.26 71.37,32.26 J1.2-3 65.66,26.54 65.66,23.75 ADC7606-B.10
V6+
  Top 0.305: SV1.6 82.3,31.37 82.3,32.38 81.66,33.02 73.66,33.02 J1.2-4 70.87,33.27 64.9,27.3 64.9,25.27 63.75,24.13 ADC7606-B.12
V7+
  Top 0.305: SV1.7 84.2,31.62 82.17,33.66 74.8,33.66 73.91,34.54 J1.2-5 63.5,26.92 ADC7606-B.14
V8+
  Top 0.305: SV1.8 84.45,34.29 74.93,34.29 73.66,35.56 J1.2-6 70.1,35.81 ADC7606-B.16

### Text on the board
tNames: 47 uF | 47 uF | + - R T P C | 1:BBB / 2: COM / 3: EXT | ^ / ext clk | 1: 5 V / 2: COM / 3: 10 V | BBB Cape v2.3 | OpenPMU | Ch: 1 2 3 4 5 6 7 8 GND | G B P 1 0 | VIPER